# EasyEDA Pro project ProProject_CM4-AC180-OpenHD_2024-05-10.epro

# Schematic STARSEA
Create Date: 2024-04-03; Page Name: P1; Project Name: RPI-CM4-STARSEA; Schematic Name: STARSEA; Update Date: 2024-04-16; Company: VVZERO.COM; Drawed: Kinchin Fong; Page Size: A4; Part Number: JLCPCB-002; Reviewed: 嘉立创EDA; Version: V0.1
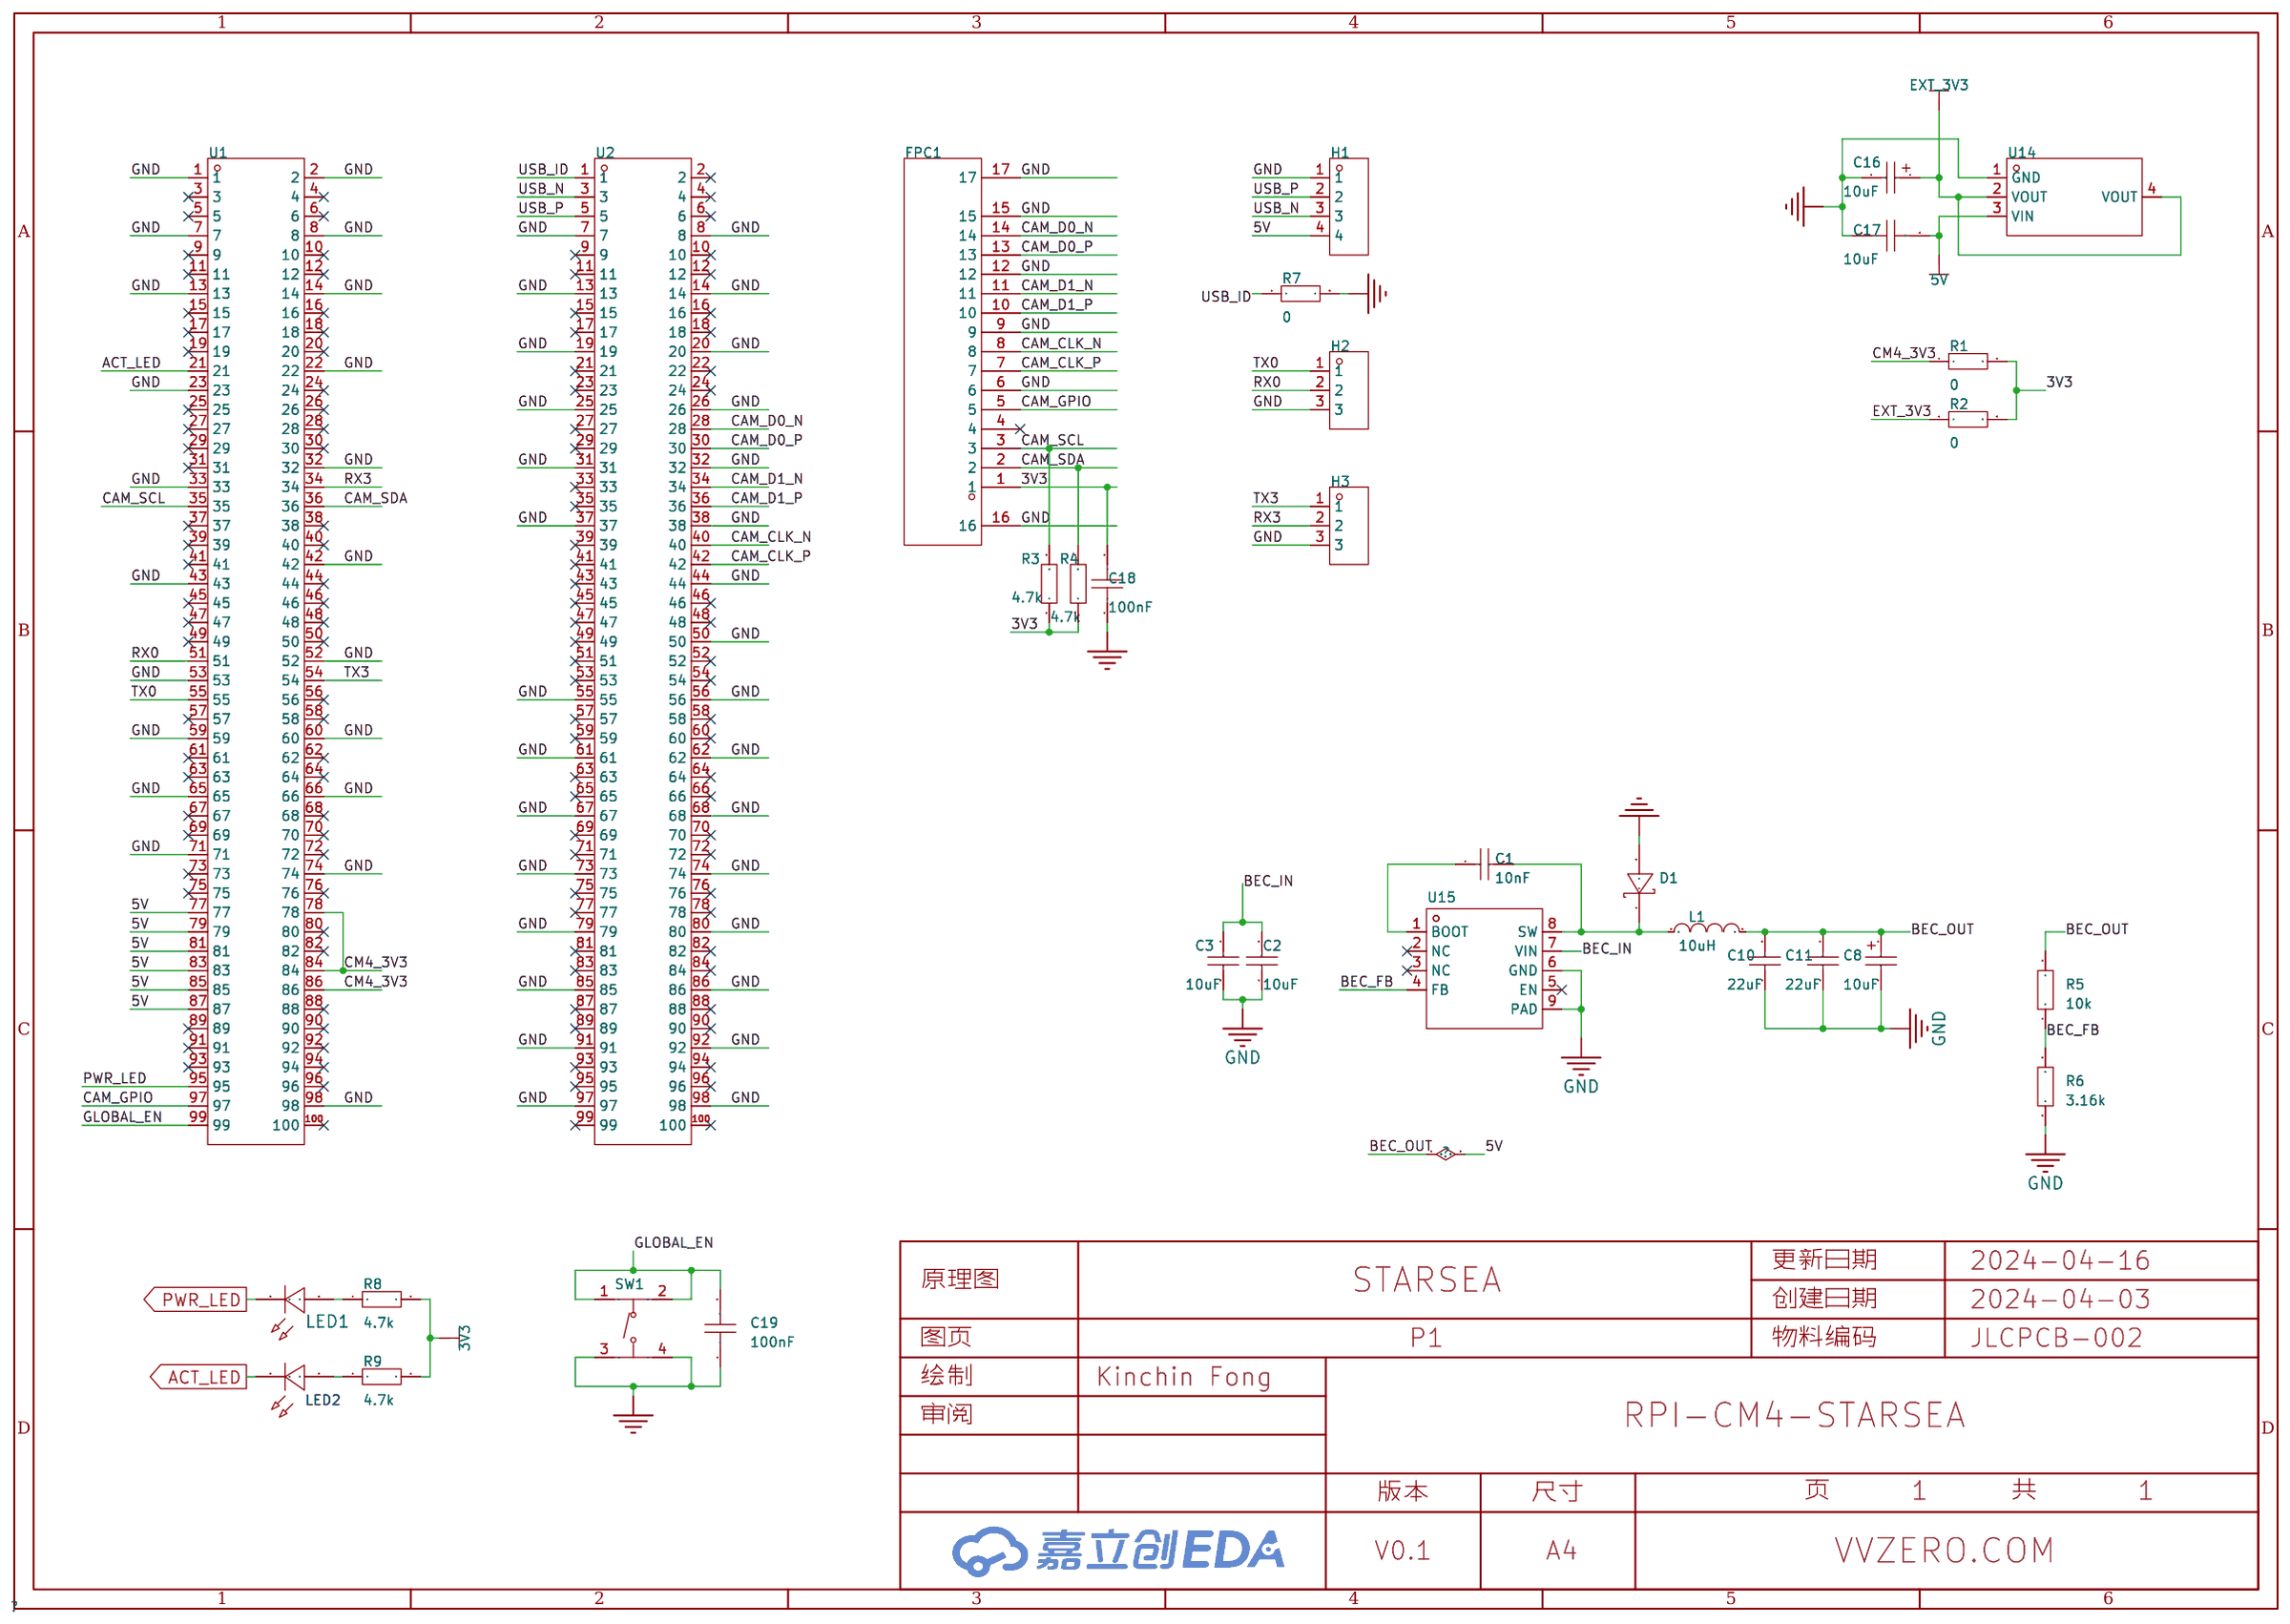
[diagram p0: schematic sheet]

## Parts
C1  10nF  [C0603]
C2  10uF  [C1206]
C3  10uF  [C1206]
C8  10uF  [CAP-SMD_L3.2-W1.6-RD-C7171]
C10  22uF  [C1206]
C11  22uF  [C1206]
C16  10uF  [CAP-SMD_L3.2-W1.6-RD-C7171]
C17  10uF  [C0603]
C18  100nF  [C0603]
C19  100nF  [C0603]
D1  SS34  [SMA_L4.3-W2.6-LS5.2-RD]
FPC1  AFA07-S15FCC-00  [FPC-SMD_AFA07-S15FCC-00]
H1  -  [HDR-TH_4P-P2.54-V-M]
H2  -  [HDR-TH_3P-P2.54-V-M]
H3  -  [HDR-TH_3P-P2.54-V-M]
L1  10uH  [IND-SMD_L7.3-W6.8]
LED1  -  [LED_0603]
LED2  -  [LED_0603]
R1  0  [R0603]
R2  0  [R0603]
R3  4.7k  [R0603]
R4  4.7k  [R0603]
R5  10k  [R0603]
R6  3.16k  [R0603]
R7  0  [R0603]
R8  4.7k  [R0603]
R9  4.7k  [R0603]
SW1  TS-1187A-B-A-B  [SW-SMD_4P-L5.1-W5.1-P3.70-LS6.5-TL-2]
U1  HC-PBB40C-100DS-0.4V-3.0-02  [CONN-SMD_100P-P0.40_X0408FVS-100F-LPV01]
U2  HC-PBB40C-100DS-0.4V-3.0-02  [CONN-SMD_100P-P0.40_X0408FVS-100F-LPV01]
U14  AMS1117-3.3  [SOT-223-3_L6.5-W3.4-P2.30-LS7.0-BR]
U15  RT8289GSP  [SOIC-8_L5.0-W4.0-P1.27-LS6.0-BL-EP2.0]

## Library data of the parts
C1 = 0603B103K500NT: 容值:10nF;精度:±10%;额定电压:50V;材质(温度系数):X7R;; LCSC Part Name: 10nF ±10% 50V; Supplier Part: C57112; Manufacturer: FH(风华); Supplier Footprint: 0603; JLCPCB Part Class: 基础库; Datasheet: https://atta.szlcsc.com/upload/public/pdf/source/20200305/C486355_26A10D38EF8C2A5C37091D0039909270.pdf; Supplier: LCSC; Tolerance: ±10%; Voltage Rated: 50V; Temperature Coefficient: X7R
C2 C3 = CL31A106KBHNNNE: 容值:10uF;精度:±10%;额定电压:50V;材质(温度系数):X5R;; LCSC Part Name: 10uF ±10% 50V; Supplier Part: C13585; Manufacturer: SAMSUNG(三星); Supplier Footprint: 1206; JLCPCB Part Class: 基础库; Datasheet: https://atta.szlcsc.com/upload/public/pdf/source/20160218/1457707763339.pdf; Supplier: LCSC; Tolerance: ±10%; Voltage Rated: 50V; Temperature Coefficient: X5R
C8 = TAJA106K016RNJ: 容值:10uF;精度:±10%;额定电压:16V;等效串联电阻:3Ω@100kHz;; LCSC Part Name: 10uF ±10% 16V; Supplier Part: C7171; Manufacturer: Kyocera AVX; Supplier Footprint: CASE-A-3216; JLCPCB Part Class: 基础库; Datasheet: https://atta.szlcsc.com/upload/public/pdf/source/20160107/1457707750344.pdf; Supplier: LCSC; Tolerance: ±10%; Rated Voltage: 16V; Equivalent Series Resistance(ESR): 3Ω@100kHz; Operating Temperature: -55℃~+125℃
C10 C11 = CL31A226KAHNNNE: 容值:22uF;精度:±10%;额定电压:25V;材质(温度系数):X5R;; LCSC Part Name: 22uF ±10% 25V; Supplier Part: C12891; Manufacturer: SAMSUNG(三星); Supplier Footprint: 1206; JLCPCB Part Class: 基础库; Datasheet: https://atta.szlcsc.com/upload/public/pdf/source/20160218/1457707763339.pdf; Supplier: LCSC; Tolerance: ±10%; Voltage Rated: 25V; Temperature Coefficient: X5R
C16 = TAJA106K016RNJ: 容值:10uF;精度:±10%;额定电压:16V;等效串联电阻:3Ω@100kHz;; LCSC Part Name: 10uF ±10% 16V; Supplier Part: C7171; Manufacturer: Kyocera AVX; Supplier Footprint: CASE-A-3216; JLCPCB Part Class: 基础库; Datasheet: https://atta.szlcsc.com/upload/public/pdf/source/20160107/1457707748093.pdf; Supplier: LCSC; Tolerance: ±10%; Rated Voltage: 16V; Equivalent Series Resistance(ESR): 3Ω@100kHz; Operating Temperature: -55℃~+125℃
C17-C19 = CAP_0603: Supplier Footprint: 0603
D1 = SS34_C8678: 二极管配置:独立式;正向压降(Vf):550mV@3A;直流反向耐压(Vr):40V;平均整流电流(Io):3A;; LCSC Part Name: 电压:40V 电流:3A; Supplier Part: C8678; Manufacturer: MDD; Supplier Footprint: SMA(DO-214AC); JLCPCB Part Class: 基础库; Datasheet: https://atta.szlcsc.com/upload/public/pdf/source/20230314/A80AE34493C69B89E2F4B1712F433538.pdf; Supplier: LCSC; Diode Configuration: 独立式; Forward Voltage (Vf@If): 550mV@3A; Reverse Voltage (Vr): 40V; Average Rectified Current (Io): 3A; Reverse Leakage Current (Ir): 500uA@40V
FPC1 = AFA07-S15FCC-00: 锁定特性:抽屉式;触点类型:下接;触点数量:15P;间距:1mm;安装类型:卧贴;; LCSC Part Name: 间距:1mm P数:15P 抽屉式 下接; Supplier Part: C262349; Manufacturer: JS(钜硕电子); Supplier Footprint: SMD,P=1mm,卧贴; JLCPCB Part Class: 扩展库; Datasheet: https://atta.szlcsc.com/upload/public/pdf/source/20191217/C262716_30B15E9A77BFCA4A54741C92DB3BE8CC.pdf; Supplier: LCSC; Locking Feature: 抽屉式; Contact Type: 下接; Number of Contacts: 15P; Pitch: 1mm; Mounting Type: 卧贴; FFC, FCB Thickness: 0.3mm; Height Above Board: 2.5mm
H1 = HDR-M_2.54_1x4P: Supplier Part: C492403; Supplier Footprint: 插件
H2 H3 = HDR-M_2.54_1x3P: Supplier Part: C2937625; Supplier Footprint: 插件
L1 = FXL0630-100-M: 电感值:10uH;精度:±20%;额定电流:4.5A;饱和电流(Isat):5.5A;类型:一体成型电感;; LCSC Part Name: 10uH ±20% 5.5A; Supplier Part: C167223; Manufacturer: cjiang(长江微电); Supplier Footprint: SMD,6.6x7mm; JLCPCB Part Class: 扩展库; Datasheet: https://atta.szlcsc.com/upload/public/pdf/source/20230516/3A080F5AF8C87BB81C3BA86E5F60E51A.pdf; Supplier: LCSC; Tolerance: ±20%; Rated Current: 4.5A; Saturation Current (Isat): 5.5A; DC Resistance (DCR): 68mΩ; Type: 一体成型电感
LED1 = LED_0603-R: Supplier Footprint: 0603
LED2 = LED_0603-G: Supplier Footprint: 0603
R1-R4 R7-R9 = Res_0603: Supplier Footprint: 0603
R5 = 0603WAF2402T5E: 电阻类型:厚膜电阻;阻值:24kΩ;精度:±1%;功率:100mW;最大工作电压:75V;温度系数:±100ppm/℃;; LCSC Part Name: 24kΩ ±1% 100mW 厚膜电阻; Supplier Part: C23352; Manufacturer: UNI-ROYAL(厚声); Supplier Footprint: 0603; JLCPCB Part Class: 基础库; Datasheet: https://atta.szlcsc.com/upload/public/pdf/source/20200306/C422600_1E6D84923E4A46A82E41ADD87F860B5C.pdf; Supplier: LCSC; Type: 厚膜电阻; Tolerance: ±1%; Power(Watts): 100mW; Overload Voltage (Max): 75V; Temperature Coefficient: ±100ppm/℃; Operating Temperature Range: -55℃~+155℃
R6 = 0603WAF2701T5E: 电阻类型:厚膜电阻;阻值:2.7kΩ;精度:±1%;功率:100mW;最大工作电压:75V;温度系数:±100ppm/℃;; LCSC Part Name: 2.7kΩ ±1% 100mW 厚膜电阻; Supplier Part: C13167; Manufacturer: UNI-ROYAL(厚声); Supplier Footprint: 0603; JLCPCB Part Class: 基础库; Datasheet: https://atta.szlcsc.com/upload/public/pdf/source/20200306/C422600_1E6D84923E4A46A82E41ADD87F860B5C.pdf; Supplier: LCSC; Type: 厚膜电阻; Tolerance: ±1%; Power(Watts): 100mW; Overload Voltage (Max): 75V; Temperature Coefficient: ±100ppm/℃; Operating Temperature Range: -55℃~+155℃
SW1 = TS-1187A-B-A-B: 电路结构:单刀单掷;按钮形状:圆形按钮;作用力:160gf;安装方式:立贴;开关长度:5.1mm;开关宽度:5.1mm;开关高度:1.5mm;带支架:不带;触点电流:50mA;额定电压(DC):12V;绝缘电阻:-;带灯:无;机械寿命:10万次;; LCSC Part Name: 5.1*5.1*1.5mm 立贴 轻触开关; Supplier Part: C318884; Manufacturer: XKB Connectivity(中国星坤); Supplier Footprint: SMD; JLCPCB Part Class: 基础库; Datasheet: https://atta.szlcsc.com/upload/public/pdf/source/20200227/C318890_053E50208A88A7BA1965D8746000774E.pdf; Supplier: LCSC; Circuit: 单刀单掷; Actuator Style: 圆形按钮; Operating Force: 160gf; Mounting Style: 立贴; Switch Length: 5.1mm; Switch Width: 5.1mm; Switch Height: 1.5mm; Strike Gundam: 不带; Contact Current: 50mA; Voltage Rating (DC): 12V; Actuator/Cap Color: 金色; With Lamp: 无; Mechanical Life: 10万次; Operating Temperature: -30℃~+85℃
U1 U2 = HC-PBB40C-100DS-0.4V-3.0-02: PIN总数:100P;间距:0.4mm;公母:母;安装方式:立贴;行数:2;额定电流:300mA;工作温度范围:-35℃~+85℃;; LCSC Part Name: PIN:100P 间距:0.4mm 母 立贴; Supplier Part: C19089295; Manufacturer: HCTL(华灿天禄); Supplier Footprint: SMD,P=0.4mm; JLCPCB Part Class: 扩展库; Datasheet: https://atta.szlcsc.com/upload/public/pdf/source/20231026/B42C748D7AAFF63F7EC2104F4CEA0747.pdf; Supplier: LCSC; Number of Pins: 100P; Pitch: 0.4mm; Gender: 母; Mounting Style: 立贴; Number of Rows: 2; Current Rating (Max): 300mA; Contact Material: 磷青铜; Operating Temperature Range: -35℃~+85℃
U14 = AMS1117-3.3_C6186: 输出类型:固定;输出极性:正;最大输入电压:-;输出电压:3.3V;输出电流:1A;电源纹波抑制比(PSRR):72dB@(120Hz);; LCSC Part Name: 输出3.3V 1A; Supplier Part: C6186; Manufacturer: AMS; Supplier Footprint: SOT-223; JLCPCB Part Class: 基础库; Datasheet: https://atta.szlcsc.com/upload/public/pdf/source/20180727/C6186_7A095716F0823C02F1997A905E26C086.pdf; Supplier: LCSC; Output Type: 固定; Output Voltage: 3.3V; MAX Output Current: 1A; Power Supply Rejection Ratio (PSRR): 72dB@(120Hz); Dropout Voltage: 1.3V@(800mA); Output Polarity: 正; Number of Outputs: 1; Output Current: 1A
U15 = RT8289GSP: 功能类型:降压型;输出类型:可调;输入电压:5.5V~32V;输出电压:1.222V~26V;输出电流(最大值):5A;; Supplier Part: C39202; Manufacturer: RICHTEK(立锜); Supplier Footprint: SOIC-8-EP; JLCPCB Part Class: 扩展库; Datasheet: https://atta.szlcsc.com/upload/public/pdf/source/20141219/1457707253176.pdf; Supplier: LCSC; Function: 降压型; Output Type: 可调; Input Voltage: 5.5V~32V; Output Voltage: 1.222V~26V; Output Current (Max): 5A; Switching Frequency: 500kHz; Operating Temperature: -40℃~+85℃@(TA); Synchronous Rectification: 否; Number of Outputs: 1; Topology: 降压式; Switch tube (built-in/external): 内置

## Nets
3V3: C18.2 FPC1.1 R1.2 R2.2 R3.1 R4.1 R8.2 R9.2
5V: C8.1 C10.2 C11.2 C17.2 H1.4 L1.2 R5.2 U1.77 U1.79 U1.81 U1.83 U1.85 U1.87 U14.3(VIN)
GND: C2.1 C3.1 C8.2 C10.1 C11.1 C16.2 C17.1 C18.1 C19.1 D1.2(A) FPC1.6 FPC1.9 FPC1.12 FPC1.15 FPC1.16 FPC1.17 H1.1 H2.3 H3.3 R6.1 R7.2 SW1.3(C) SW1.4(D) U1.1 U1.2 U1.7 U1.8 U1.13 U1.14 U1.22 U1.23 U1.32 U1.33 U1.42 U1.43 U1.52 U1.53 U1.59 U1.60 U1.65 U1.66 U1.71 U1.74 U1.98 U2.7 U2.8 U2.13 U2.14 U2.19 U2.20 U2.25 U2.26 U2.31 U2.32 U2.37 U2.38 U2.44 U2.50 U2.55 U2.56 U2.61 U2.62 U2.67 U2.68 U2.73 U2.74 U2.79 U2.80 U2.85 U2.86 U2.91 U2.92 U2.97 U2.98 U14.1(GND) U15.6(GND) U15.9(PAD)
ACT_LED: LED2.1(C) U1.21
BEC_FB: R5.1 R6.2 U15.4(FB)
BEC_IN: C2.2 C3.2 U15.7(VIN)
CAM_CLK_N: FPC1.8 U2.40
CAM_CLK_P: FPC1.7 U2.42
CAM_D0_N: FPC1.14 U2.28
CAM_D0_P: FPC1.13 U2.30
CAM_D1_N: FPC1.11 U2.34
CAM_D1_P: FPC1.10 U2.36
CAM_GPIO: FPC1.5 U1.97
CAM_SCL: FPC1.3 R3.2 U1.35
CAM_SDA: FPC1.2 R4.2 U1.36
CM4_3V3: R1.1 U1.78 U1.84 U1.86
EXT_3V3: C16.1 R2.1 U14.2(VOUT) U14.4(VOUT)
GLOBAL_EN: C19.2 SW1.1(A) SW1.2(B) U1.99
PWR_LED: LED1.1(C) U1.95
RX0: H2.2 U1.51
RX3: H3.2 U1.34
TX0: H2.1 U1.55
TX3: H3.1 U1.54
USB_ID: R7.1 U2.1
USB_N: H1.3 U2.3
USB_P: H1.2 U2.5
$1N6118: C1.2 D1.1(K) L1.1 U15.8(SW)
$1N6119: C1.1 U15.1(BOOT)
$1N8732: LED1.2(A) R8.1
$1N8740: LED2.2(A) R9.1

Not connected (* = marked no-connect by the designer): FPC1 4*; U1 3* 4* 5* 6* 9* 10* 11* 12* 15* 16* 17* 18* 19* 20* 24* 25* 26* 27* 28* 29* 30* 31* 37* 38* 39* 40* 41* 44* 45* 46* 47* 48* 49* 50* 56* 57* 58* 61* 62* 63* 64* 67* 68* 69* 70* 72* 73* 75* 76* 80* 82* 88* 89* 90* 91* 92* 93* 94* 96* 100*; U2 2* 4* 6* 9* 10* 11* 12* 15* 16* 17* 18* 21* 22* 23* 24* 27* 29* 33* 35* 39* 41* 43* 45* 46* 47* 48* 49* 51* 52* 53* 54* 57* 58* 59* 60* 63* 64* 65* 66* 69* 70* 71* 72* 75* 76* 77* 78* 81* 82* 83* 84* 87* 88* 89* 90* 93* 94* 95* 96* 99* 100*; U15 2(NC)* 3(NC)* 5(EN)*

# Board STARSEA_PCB
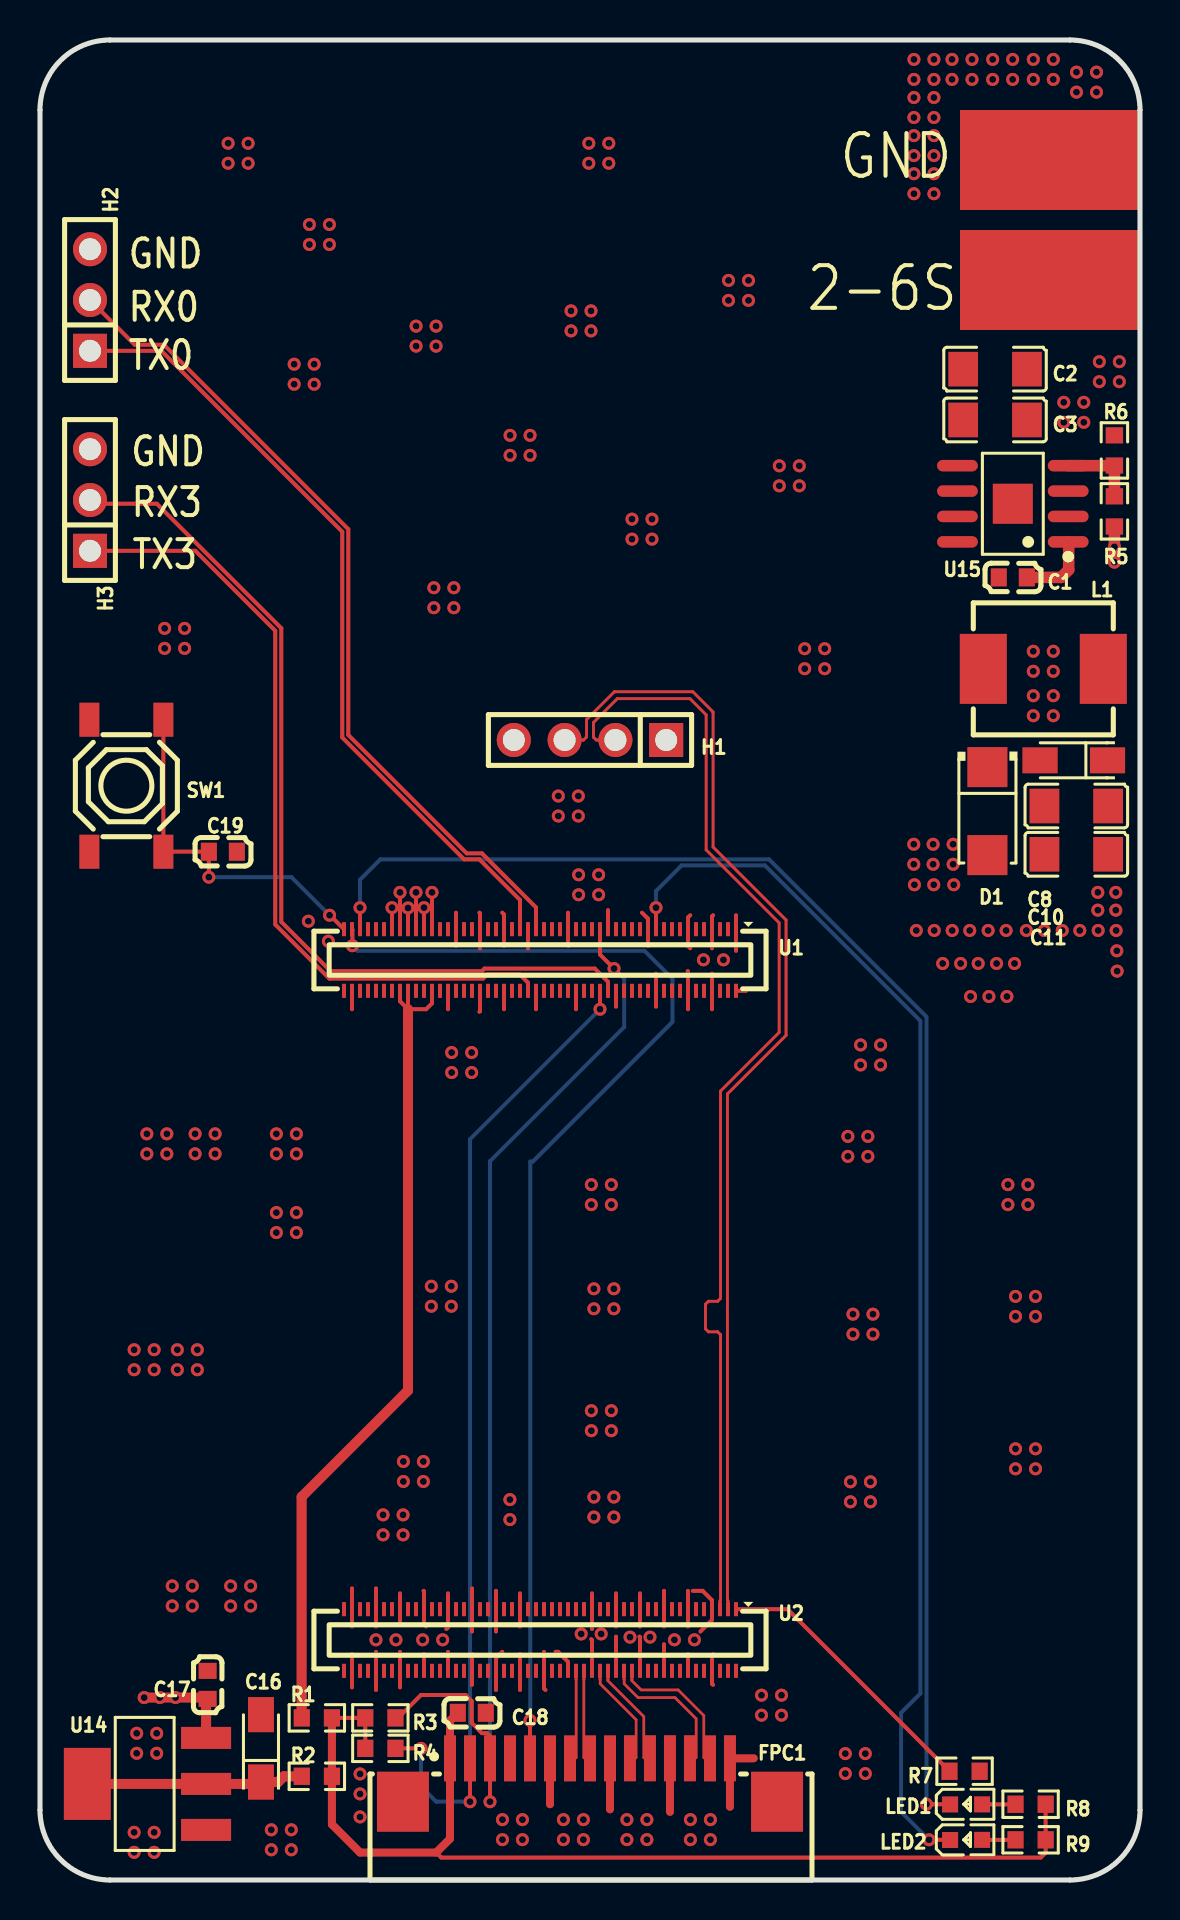
[diagram p1: board, top side]
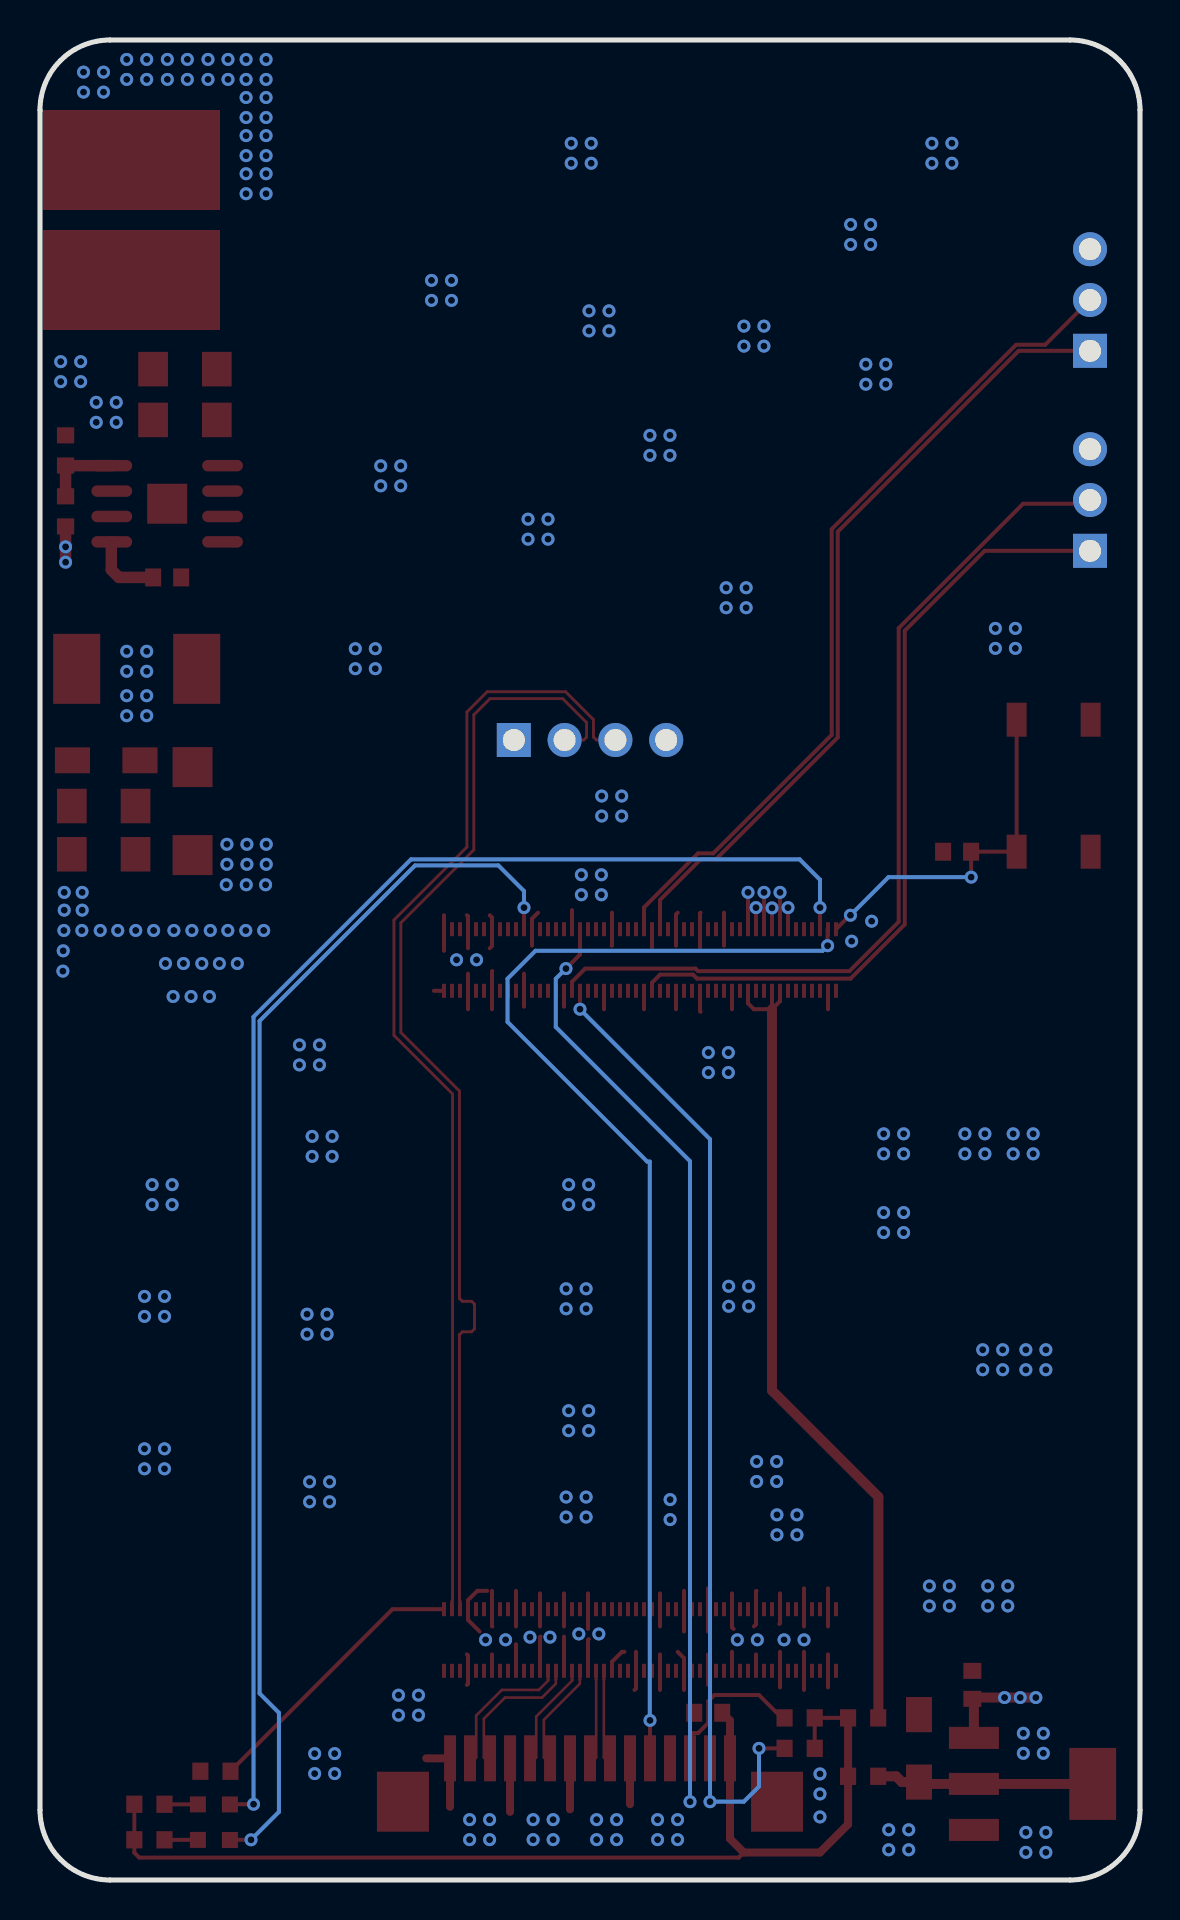
[diagram p2: board, bottom side, seen from below]

Outline 55 x 92 mm; copper layers: Top Layer, Inner1, Inner2, Bottom Layer. Coordinates in mm from the lower left corner of the outline.
Outline path: 0,88.5 0,3.5 arc(1.03,1.03) 3.5,0 51.5,0 arc(53.97,1.03) 55,3.5 55,88.5 arc(53.97,90.97) 51.5,92 3.5,92 arc(1.03,90.97) 0,88.5
Stack: Top Layer 0.035mm 外层铜厚1oz / Dielectric1 0.2104mm 7628 RC49% 8.6mil / Inner1 0.0152mm 内层铜厚 / Dielectric2 1.065mm 1.1mm H/HOZ 含铜 / Inner2 0.0152mm 内层铜厚 / Dielectric3 0.2104mm 7628 RC49% 8.6mil / Bottom Layer 0.035mm 外层铜厚1oz

## Design rules (mm)
net USB_N: USB
net USB_P: USB
net CAM_D0_N: CAM_D0
net CAM_D0_P: CAM_D0
net CAM_D1_N: CAM_D1
net CAM_D1_P: CAM_D1
net CAM_CLK_N: CAM_CLK
net CAM_CLK_P: CAM_CLK
template: JLC041611-3313
spacing copperThickness1oz (default): track to track 0.102, other pairs 0 to 0.3
track width copperThickness1oz (default): min 0.1, default 0.2, max 2.5
differential pair differentialPair (default): width min 0.1, default 0.25, max 2.5; gap min 0.15, default 0.15
differential pair USB: width min 0.146, default 0.146, max 0.146; gap min 0.2, default 0.2
differential pair CSI-2: width min 0.133, default 0.133, max 0.133; gap min 0.25, default 0.25
via viaSize (default): diameter min 0.3, default 0.65, max 10; hole min 0.2, default 0.35, max 7
net USB_N uses USB
net USB_P uses USB
net CAM_D0_N uses CSI-2
net CAM_D0_P uses CSI-2
net CAM_D1_N uses CSI-2
net CAM_D1_P uses CSI-2
net CAM_CLK_N uses CSI-2
net CAM_CLK_P uses CSI-2
diff pair USB uses USB
diff pair CAM_D0 uses CSI-2
diff pair CAM_D1 uses CSI-2
diff pair CAM_CLK uses CSI-2
['net', 'gnd'] ['NET', 'USB_N'] uses copper_diffpair
['net', 'gnd'] ['NET', 'USB_P'] uses copper_diffpair
['net', 'gnd'] ['NET', 'CAM_D0_N'] uses copper_diffpair
['net', 'gnd'] ['NET', 'CAM_D0_P'] uses copper_diffpair
['net', 'gnd'] ['NET', 'CAM_D1_N'] uses copper_diffpair
['net', 'gnd'] ['NET', 'CAM_D1_P'] uses copper_diffpair
['net', 'gnd'] ['NET', 'CAM_CLK_N'] uses copper_diffpair
['net', 'gnd'] ['NET', 'CAM_CLK_P'] uses copper_diffpair
pour e1534 uses power
pour e1536 uses power
pour e1538 uses power
pour e1544 uses power
pour e1553 uses power
pour e1616 uses power

## Placement (name value [footprint] x y rotation side)
C1  10nF  [C0603]  48.64 65.13 180 top
C2  10uF  [C1206]  47.75 75.54 180 top
C3  10uF  [C1206]  47.75 73 180 top
C8  10uF  [CAP-SMD_L3.2-W1.6-RD-C7171]  51.69 55.98 180 top
C10  22uF  [C1206]  51.82 53.7 0 top
C11  22uF  [C1206]  51.82 51.29 0 top
C16  10uF  [CAP-SMD_L3.2-W1.6-RD-C7171]  11.05 6.58 90 top
C17  10uF  [C0603]  8.38 9.76 270 top
C18  100nF  [C0603]  21.59 8.36 180 top
C19  100nF  [C0603]  9.14 51.41 180 top
D1  SS34  [SMA_L4.3-W2.6-LS5.2-RD]  47.37 53.44 270 top
FPC1  AFA07-S15FCC-00  [FPC-SMD_AFA07-S15FCC-00]  27.5 5 0 top
H1  -  [HDR-TH_4P-P2.54-V-M]  27.5 57 180 top
H2  -  [HDR-TH_3P-P2.54-V-M]  2.5 79 90 top
H3  -  [HDR-TH_3P-P2.54-V-M]  2.5 69 90 top
L1  10uH  [IND-SMD_L7.3-W6.8]  50.16 60.56 0 top
LED1  -  [LED_0603]  46.35 3.79 0 top
LED2  -  [LED_0603]  46.35 2.01 0 top
NOREF  -  [Pad_e49]  50.5 80 0 top
NOREF#2  -  [Pad_e48]  50.5 86 0 top
R1  0  [R0603]  13.84 8.11 0 top
R2  0  [R0603]  13.84 5.19 0 top
R3  4.7k  [R0603]  17.02 8.11 0 top
R4  4.7k  [R0603]  17.02 6.58 0 top
R5  10k  [R0603]  53.72 68.43 270 top
R6  3.16k  [R0603]  53.72 71.48 270 top
R7  0  [R0603]  46.23 5.44 0 top
R8  4.7k  [R0603]  49.53 3.79 0 top
R9  4.7k  [R0603]  49.53 2.01 0 top
SW1  TS-1187A-B-A-B  [SW-SMD_4P-L5.1-W5.1-P3.70-LS6.5-TL-2]  4.32 54.72 270 top
U1  HC-PBB40C-100DS-0.4V-3.0-02  [CONN-SMD_100P-P0.40_X0408FVS-100F-LPV01]  25 46 180 top
U2  HC-PBB40C-100DS-0.4V-3.0-02  [CONN-SMD_100P-P0.40_X0408FVS-100F-LPV01]  25 12 180 top
U14  AMS1117-3.3  [SOT-223-3_L6.5-W3.4-P2.30-LS7.0-BR]  5.33 4.8 0 top
U15  RT8289GSP  [SOIC-8_L5.0-W4.0-P1.27-LS6.0-BL-EP2.0]  48.64 68.81 90 top

## Footprints (pads in the part's own frame, mm; a bottom-side part is the same pattern mirrored in y, then rotated)
C0603
  rect 0.8x0.9 smd: 1(-0.7,0) 2(0.7,0)
C1206
  rect 1.485x1.728 smd: 1(-1.593,0) 2(1.593,0)
CAP-SMD_L3.2-W1.6-RD-C7171
  rect 1.758x1.296 smd: 1(-1.687,0) 2(1.687,0)
CONN-SMD_100P-P0.40_X0408FVS-100F-LPV01
  rect 0.2x0.7 smd: 1(-9.8,-1.54) 2(-9.8,1.54) 3(-9.4,-1.54) 4(-9.4,1.54) 5(-9,-1.54) 6(-9,1.54) 7(-8.6,-1.54) 8(-8.6,1.54) 9(-8.2,-1.54) 10(-8.2,1.54) 11(-7.8,-1.54) 12(-7.8,1.54) 13(-7.4,-1.54) 14(-7.4,1.54) 15(-7,-1.54) 16(-7,1.54) 17(-6.6,-1.54) 18(-6.6,1.54) 19(-6.2,-1.54) 20(-6.2,1.54) 21(-5.8,-1.54) 22(-5.8,1.54) 23(-5.4,-1.54) 24(-5.4,1.54) 25(-5,-1.54) 26(-5,1.54) 27(-4.6,-1.54) 28(-4.6,1.54) 29(-4.2,-1.54) 30(-4.2,1.54) 31(-3.8,-1.54) 32(-3.8,1.54) 33(-3.4,-1.54) 34(-3.4,1.54) 35(-3,-1.54) 36(-3,1.54) 37(-2.6,-1.54) 38(-2.6,1.54) 39(-2.2,-1.54) 40(-2.2,1.54) 41(-1.8,-1.54) 42(-1.8,1.54) 43(-1.4,-1.54) 44(-1.4,1.54) 45(-1,-1.54) 46(-1,1.54) 47(-0.6,-1.54) 48(-0.6,1.54) 49(-0.2,-1.54) 50(-0.2,1.54) 51(0.2,-1.54) 52(0.2,1.54) 53(0.6,-1.54) 54(0.6,1.54) 55(1,-1.54) 56(1,1.54) 57(1.4,-1.54) 58(1.4,1.54) 59(1.8,-1.54) 60(1.8,1.54) 61(2.2,-1.54) 62(2.2,1.54) 63(2.6,-1.54) 64(2.6,1.54) 65(3,-1.54) 66(3,1.54) 67(3.4,-1.54) 68(3.4,1.54) 69(3.8,-1.54) 70(3.8,1.54) 71(4.2,-1.54) 72(4.2,1.54) 73(4.6,-1.54) 74(4.6,1.54) 75(5,-1.54) 76(5,1.54) 77(5.4,-1.54) 78(5.4,1.54) 79(5.8,-1.54) 80(5.8,1.54) 81(6.2,-1.54) 82(6.2,1.54) 83(6.6,-1.54) 84(6.6,1.54) 85(7,-1.54) 86(7,1.54) 87(7.4,-1.54) 88(7.4,1.54) 89(7.8,-1.54) 90(7.8,1.54) 91(8.2,-1.54) 92(8.2,1.54) 93(8.6,-1.54) 94(8.6,1.54) 95(9,-1.54) 96(9,1.54) 97(9.4,-1.54) 98(9.4,1.54) 99(9.8,-1.54) 100(9.8,1.54)
FPC-SMD_AFA07-S15FCC-00
  rect 0.6x2.3 smd: 1(-7,1.083) 2(-6,1.083) 3(-5,1.083) 4(-4,1.083) 5(-3,1.083) 6(-2,1.083) 7(-1,1.083) 8(0,1.083) 9(1,1.083) 10(1.998,1.085) 11(2.998,1.085) 12(3.998,1.085) 13(4.998,1.085) 14(6,1.083) 15(6.998,1.085)
  rect 2.6x3 smd: 16(-9.352,-1.085) 17(9.352,-1.085)
HDR-TH_3P-P2.54-V-M
  rect 1.7x1.7 hole 1.1: 1(-2.54,0)
  round 1.7 hole 1.1: 2(0,0) 3(2.54,0)
HDR-TH_4P-P2.54-V-M
  rect 1.7x1.7 hole 1.1: 1(-3.81,0)
  round 1.7 hole 1.1: 2(-1.27,0) 3(1.27,0) 4(3.81,0)
IND-SMD_L7.3-W6.8
  rect 2.35x3.5 smd: 1(-3,0) 2(3,0)
LED_0603
  rect 0.8x0.8 smd: 1(-0.851,-0.01) 2(0.75,-0.005)
Pad_e48
  rect 9x5 smd: 101(0,0)
Pad_e49
  rect 9x5 smd: 102(0,0)
R0603
  rect 0.806x0.864 smd: 1(-0.753,0) 2(0.753,0)
SMA_L4.3-W2.6-LS5.2-RD
  rect 2x2 smd: 1(-2.2,0) 2(2.2,0)
SOIC-8_L5.0-W4.0-P1.27-LS6.0-BL-EP2.0
  oval 0.574x2.038 smd: 1(-1.905,-2.769) 2(-0.635,-2.769) 3(0.635,-2.769) 4(1.905,-2.769) 5(1.905,2.769) 6(0.635,2.769) 7(-0.635,2.769) 8(-1.905,2.769)
  rect 2x2 smd: 9(0,0)
SOT-223-3_L6.5-W3.4-P2.30-LS7.0-BR
  rect 2.5x1.1 smd: 1(2.97,-2.3) 2(2.97,0) 3(2.97,2.3)
  rect 2.34x3.6 smd: 4(-2.97,0)
SW-SMD_4P-L5.1-W5.1-P3.70-LS6.5-TL-2
  rect 1.7x1 smd: 1(-3.3,1.85) 2(3.3,1.85) 3(-3.3,-1.85) 4(3.3,-1.85)

## Nets
As in the schematic, except:
GND: C2.1 C3.1 C8.2 C10.1 C11.1 C16.2 C17.1 C18.1 C19.1 D1.2 FPC1.6 FPC1.9 FPC1.12 FPC1.15 FPC1.16 FPC1.17 H1.1 H2.3 H3.3 NOREF#2.101 R6.1 R7.2 SW1.3 SW1.4 U1.1 U1.2 U1.7 U1.8 U1.13 U1.14 U1.22 U1.23 U1.32 U1.33 U1.42 U1.43 U1.52 U1.53 U1.59 U1.60 U1.65 U1.66 U1.71 U1.74 U1.98 U2.7 U2.8 U2.13 U2.14 U2.19 U2.20 U2.25 U2.26 U2.31 U2.32 U2.37 U2.38 U2.44 U2.50 U2.55 U2.56 U2.61 U2.62 U2.67 U2.68 U2.73 U2.74 U2.79 U2.80 U2.85 U2.86 U2.91 U2.92 U2.97 U2.98 U14.1 U15.6 U15.9
BEC_IN: C2.2 C3.2 NOREF.102 U15.7

Pads without a net: FPC1 4; U1 3 4 5 6 9 10 11 12 15 16 17 18 19 20 24 25 26 27 28 29 30 31 37 38 39 40 41 44 45 46 47 48 49 50 56 57 58 61 62 63 64 67 68 69 70 72 73 75 76 80 82 88 89 90 91 92 93 94 96 100; U2 2 4 6 9 10 11 12 15 16 17 18 21 22 23 24 27 29 33 35 39 41 43 45 46 47 48 49 51 52 53 54 57 58 59 60 63 64 65 66 69 70 71 72 75 76 77 78 81 82 83 84 87 88 89 90 93 94 95 96 99 100; U15 2 3 5

## Via types
v1: diameter 0.65, hole 0.35, Top Layer to Bottom Layer, 314 vias

## Routing (per net, layer and track width the routed paths; a pad name or vN(x,y) marks a point on that pad's centre or on a via; arc(x,y) is an arc through that point)
3V3: length 54.8
  Top Layer w0.2: R8.2 R9.2 50.28,1.37 50.04,1.12 20.07,1.12 19.81,1.38 ; R4.1 R3.1 R1.2
  Top Layer w0.4: C18.2 20.5,7.97 FPC1.1 20.5,2.06 19.81,1.38 16,1.38 14.6,2.78 R2.2 R1.2
5V: length 17.7
  Top Layer w0.2: 18,48.62 v1(17.6,48.62) U1.87 ; 18,48.62 v1(18,49.38) ; 18,48.62 U1.85 ; 18,48.62 18.8,48.62 ; v1(19.2,48.62) 19.6,48.62 ; v1(19.2,48.62) U1.79 ; v1(19.2,48.62) 18.8,48.62 ; 19.6,48.62 U1.77 ; 19.6,48.62 v1(19.6,49.38) ; U1.81 18.8,48.62 ; 18.8,48.62 v1(18.8,49.38) ; U1.83 v1(18.4,48.6)
  Top Layer w0.5: U14.3 8.3,8.98 8.38,9.06 8.32,9.12 v1(6.77,9.12) v1(5.99,9.12) v1(5.21,9.12)
  Top Layer w0.574: v1(53.72,65.89) v1(53.72,66.66) R5.2
  vias: v1(43.81,47.48) v1(44.71,47.48) v1(45.13,45.83) v1(45.61,47.48) v1(46.03,45.83) v1(46.49,47.48) v1(46.53,44.17) v1(46.91,45.83) v1(47.41,47.48) v1(47.45,44.17) v1(47.83,45.83) v1(48.3,47.48) v1(48.35,44.17) v1(48.73,45.83) v1(49.32,47.48) v1(50.21,47.48) v1(51.11,47.48) v1(51.99,47.48) v1(52.89,49.38) v1(52.89,48.49) v1(52.91,47.48) v1(53.79,49.38) v1(53.79,48.49) v1(53.81,47.48) v1(53.84,46.46) v1(53.86,45.44)
GND: length 89.9
  Top Layer w0.2: 15.6,12.68 U2.97 15.6,14.58 ; U1.66 22,43.44 21.97,43.41 ; 26.4,48.36 U1.43 26.4,46.73 26.42,46.71 ; 24,11.28 U2.56 24,9.5 ; 33.6,45.32 U1.8 33.6,43.54 ; 29.97,12.17 30,12.14 U2.26 ; 23.11,48.36 23.2,48.28 U1.59 23.2,46.71 ; U2.32 28.8,12.17 ; U1.98 15.6,43.54 ; 18,11.41 U2.86 18,9.63 ; 22.8,12.42 U2.61 22.8,14.46 ; 25.2,11.41 U2.50 25.2,9.58 25.27,9.5 ; 30,14.33 U2.25 30,12.68 ; U1.74 20.4,43.54 ; 20.8,46.71 U1.71 20.8,48.36 ; U1.42 26.8,43.54 ; 33.6,46.59 U1.7 33.6,48.18 33.66,48.24 ; U1.53 24.4,46.59 ; 19.3,12.68 19.2,12.78 U2.79 19.2,14.43 19.18,14.46 ; 25.78,11.41 25.9,11.41 26.4,10.91 U2.44 ; 32.51,46.59 32.4,46.7 U1.13 32.4,48.13 32.51,48.24 ; 18.03,12.81 18,12.84 U2.85 18,14.33 ; 32.4,43.54 U1.14 32.4,45.43 32.38,45.44 ; U2.80 19.2,11.28 ; U2.38 27.6,12 27.56,12.04 ; 32.38,12.68 32.4,12.69 U2.13 32.4,14.46 ; 30.8,43.67 U1.22 30.8,45.32 ; 23.11,11.41 22.8,11.09 U2.62 22.8,9.5 ; 21.6,11.28 U2.68 21.6,9.76 ; 21.6,14.58 U2.67 21.6,12.42 ; 27.6,14.33 U2.37 27.6,12.55 ; 21.97,48.36 22,48.34 U1.65 22,46.59 ; 30.1,48.36 30.4,48.06 U1.23 30.4,46.71 ; 16.8,14.58 U2.91 16.8,12.68 ; 33.66,11.28 33.6,11.23 U2.8 33.6,9.81 33.66,9.76 ; U2.20 31.2,11.79 ; 16.8,9.5 U2.92 16.8,11.41 ; 24,14.33 U2.55 24,12.68 ; U1.33 28.4,48.49 ; 31.2,12.68 U2.19 31.2,14.46 ; 28.8,14.33 U2.31 28.8,12.68 ; 34.8,46.46 U1.1 34.8,48.24 ; 32.64,14.46 33.13,14.46 33.6,13.99 U2.7 33.6,13 33.02,12.42 ; U1.52 24.8,43.54 ; 20.32,12.55 20.4,12.63 U2.73 20.4,14.33 ; 15.6,11.28 U2.98 15.6,9.63 ; U1.32 28.8,43.67 ; U1.2 35.31,44.46 ; U1.60 23.2,43.54 ; U2.14 32.4,11.28 ; U2.74 20.4,11.41
  Top Layer w0.4: 35.69,6.09 FPC1.15 34.5,3.66 ; FPC1.9 28.5,3.53 ; FPC1.6 25.5,3.79 ; FPC1.12 31.5,3.41
  vias: v1(4.71,26.51) v1(4.71,25.51) v1(4.71,2.38) v1(4.71,1.38) v1(4.83,7.34) v1(4.83,6.34) v1(5.34,37.31) v1(5.34,36.31) v1(5.71,26.51) v1(5.71,25.51) v1(5.71,2.38) v1(5.71,1.38) v1(5.83,7.34) v1(5.83,6.34) v1(6.23,62.58) v1(6.23,61.58) v1(6.34,37.31) v1(6.34,36.31) v1(6.61,14.7) v1(6.61,13.7) v1(6.87,26.51) v1(6.87,25.51) v1(7.23,62.58) v1(7.23,61.58) v1(7.61,14.7) v1(7.61,13.7) v1(7.75,37.31) v1(7.75,36.31) v1(7.87,26.51) v1(7.87,25.51) v1(8.75,37.31) v1(8.75,36.31) v1(9.41,86.84) v1(9.41,85.84) v1(9.53,14.7) v1(9.53,13.7) v1(10.41,86.84) v1(10.41,85.84) v1(10.53,14.7) v1(10.53,13.7) v1(11.56,2.51) v1(11.56,1.51) v1(11.82,37.31) v1(11.82,36.31) v1(11.82,33.37) v1(11.82,32.37) v1(12.56,2.51) v1(12.56,1.51) v1(12.71,75.79) v1(12.71,74.79) v1(12.82,37.31) v1(12.82,36.31) v1(12.82,33.37) v1(12.82,32.37) v1(13.42,47.94) v1(13.47,82.77) v1(13.47,81.77) v1(13.71,75.79) v1(13.71,74.79) v1(14.42,46.94) v1(14.47,82.77) v1(14.47,81.77) v1(16,5.3) v1(16,4.3) v1(16,3.15) v1(16.8,12.01) v1(17.15,18.26) v1(17.15,17.26) v1(17.8,12.01) v1(18.17,20.93) v1(18.17,19.93) v1(18.15,18.26) v1(18.15,17.26) v1(18.8,77.69) v1(18.8,76.69) v1(19.13,12.01) v1(19.17,20.93) v1(19.17,19.93) v1(19.57,29.69) v1(19.57,28.69) v1(19.69,64.61) v1(19.69,63.61) v1(19.8,77.69) v1(19.8,76.69) v1(20.13,12.01) v1(20.58,41.37) v1(20.58,40.37) v1(20.57,29.69) v1(20.57,28.69) v1(20.69,64.61) v1(20.69,63.61) v1(21.58,41.37) v1(21.58,40.37) v1(23.12,3.02) v1(23.12,2.02) v1(23.5,72.23) v1(23.5,71.23) v1(23.5,19.02) v1(23.5,18.02) v1(24.12,3.02) v1(24.12,2.02) v1(24.5,72.23) v1(24.5,71.23) v1(25.92,54.2) v1(25.92,53.2) v1(26.17,3.02) v1(26.17,2.02) v1(26.55,78.46) v1(26.55,77.46) v1(26.92,54.2) v1(26.92,53.2) v1(26.93,50.26) v1(26.93,49.26) v1(27.06,12.3) v1(27.17,3.02) v1(27.17,2.02) v1(27.44,86.84) v1(27.44,85.84) v1(27.55,78.46) v1(27.55,77.46) v1(27.57,34.77) v1(27.57,33.77) v1(27.57,23.47) v1(27.57,22.47) v1(27.69,29.56) v1(27.69,28.56) v1(27.69,19.15) v1(27.69,18.15) v1(27.93,50.26) v1(27.93,49.26) v1(28.06,12.3) v1(28.44,86.84) v1(28.44,85.84) v1(28.57,34.77) v1(28.57,33.77) v1(28.57,23.47) v1(28.57,22.47) v1(28.69,29.56) v1(28.69,28.56) v1(28.69,19.15) v1(28.69,18.15) v1(29.34,3.02) v1(29.34,2.02) v1(29.5,12.14) v1(29.6,68.04) v1(29.6,67.04) v1(30.34,3.02) v1(30.34,2.02) v1(30.5,12.14) v1(30.6,68.04) v1(30.6,67.04) v1(31.72,12.01) v1(32.52,3.02) v1(32.52,2.02) v1(32.72,12.01) v1(33.17,46.01) v1(33.52,3.02) v1(33.52,2.02) v1(34.17,46.01) v1(34.43,79.98) v1(34.43,78.98) v1(35.43,79.98) v1(35.43,78.98) v1(36.08,9.24) v1(36.08,8.24) v1(36.97,70.71) v1(36.97,69.71) v1(37.08,9.24) v1(37.08,8.24) v1(37.97,70.71) v1(37.97,69.71) v1(38.24,61.56) v1(38.24,60.56) v1(39.24,61.56) v1(39.24,60.56) v1(40.27,6.32) v1(40.27,5.32) v1(40.39,37.18) v1(40.39,36.18) v1(40.52,19.91) v1(40.52,18.91) v1(40.65,28.29) v1(40.65,27.29) v1(41.03,41.75) v1(41.03,40.75) v1(41.27,6.32) v1(41.27,5.32) v1(41.39,37.18) v1(41.39,36.18) v1(41.52,19.91) v1(41.52,18.91) v1(41.65,28.29) v1(41.65,27.29) v1(42.03,41.75) v1(42.03,40.75) v1(43.7,91.03) v1(43.7,90.03) v1(43.7,89.12) v1(43.7,88.12) v1(43.7,87.22) v1(43.7,86.22) v1(43.7,85.31) v1(43.7,84.31) v1(43.69,51.79) v1(43.69,50.79) v1(43.72,49.76) v1(44.7,91.03) v1(44.7,90.03) v1(44.7,89.12) v1(44.7,88.12) v1(44.7,87.22) v1(44.7,86.22) v1(44.7,85.31) v1(44.7,84.31) v1(44.66,51.79) v1(44.66,50.79) v1(44.69,49.76) v1(45.6,91.03) v1(45.6,90.03) v1(45.66,51.79) v1(45.66,50.79) v1(45.69,49.76) v1(46.6,91.03) v1(46.6,90.03) v1(47.63,91.03) v1(47.63,90.03) v1(48.4,34.77) v1(48.4,33.77) v1(48.63,91.03) v1(48.63,90.03) v1(48.78,29.18) v1(48.78,28.18) v1(48.78,21.56) v1(48.78,20.56) v1(49.4,34.77) v1(49.4,33.77) v1(49.66,91.03) v1(49.66,90.03) v1(49.66,61.44) v1(49.66,60.44) v1(49.66,59.21) v1(49.66,58.21) v1(49.78,29.18) v1(49.78,28.18) v1(49.78,21.56) v1(49.78,20.56) v1(50.66,91.03) v1(50.66,90.03) v1(50.66,61.44) v1(50.66,60.44) v1(50.66,59.21) v1(50.66,58.21) v1(51.19,73.88) v1(51.19,72.88) v1(51.82,90.39) v1(51.82,89.39) v1(52.19,73.88) v1(52.19,72.88) v1(52.82,90.39) v1(52.82,89.39) v1(52.97,75.92) v1(52.97,74.92) v1(53.97,75.92) v1(53.97,74.92)
ACT_LED: length 61.9
  Top Layer w0.2: U1.21 v1(30.8,48.62) ; v1(44.45,2.01) 45.43,2.01 45.44,2 LED2.1
  Bottom Layer w0.2: v1(44.45,2.01) 43.05,3.41 43.05,8.36 44.02,9.33 44.02,42.95 36.24,50.73 32.08,50.73 30.8,49.45 v1(30.8,48.62)
BEC_FB: length 3.9
  Top Layer w0.574: U15.4 53.71,70.72 R6.2 R5.1
CAM_CLK_N: length 4.7
  Top Layer w0.133: U2.40 27.2,10.04 27.19,10.03 27.19,6.13 27.24,6.08 FPC1.8
CAM_CLK_P: length 4.7
  Top Layer w0.133: U2.42 26.8,10.04 26.81,10.03 26.81,6.13 26.76,6.08 FPC1.7
CAM_D0_N: length 7.2
  Top Layer w0.133: FPC1.14 33.24,6.08 33.19,6.13 33.19,8.22 31.91,9.5 30.06,9.5 29.59,9.97 29.59,10.03 29.6,10.04 U2.28
CAM_D0_P: length 7.2
  Top Layer w0.133: U2.30 29.2,10.04 29.21,10.03 29.21,9.81 29.9,9.12 31.75,9.12 32.81,8.06 32.81,6.13 32.76,6.09 FPC1.13
CAM_D1_N: length 5.4
  Top Layer w0.133: U2.34 28.4,10.04 28.39,10.03 28.39,9.97 30.19,8.17 30.19,6.13 30.24,6.09 FPC1.11
CAM_D1_P: length 5.4
  Top Layer w0.133: FPC1.10 29.76,6.09 29.81,6.13 29.81,8.01 28.01,9.81 28.01,10.03 28,10.04 U2.36
CAM_GPIO: length 59.5
  Top Layer w0.2: v1(15.62,46.71) 15.62,47.52 U1.97 ; FPC1.5 v1(24.5,7.98)
  Bottom Layer w0.2: v1(15.62,46.71) 15.88,46.46 30.23,46.46 31.62,45.06 31.62,42.9 24.64,35.92 24.51,35.92 24.51,7.99 v1(24.5,7.98)
CAM_SCL: length 56.9
  Top Layer w0.2: R3.2 17.91,8.11 19.05,9.25 21.28,9.25 21.59,8.94 21.59,7.85 22.1,7.34 22.35,7.34 22.5,7.2 FPC1.3 v1(22.5,3.91) ; v1(28.7,45.57) 28,46.27 U1.35
  Bottom Layer w0.2: v1(28.7,45.57) 29.21,45.06 29.21,42.65 22.5,35.94 v1(22.5,3.91)
CAM_SDA: length 51.4
  Top Layer w0.2: R4.2 v1(19.05,6.58) ; v1(28,43.54) U1.36 ; FPC1.2 v1(21.5,3.91)
  Bottom Layer w0.2: v1(28,43.54) 21.5,37.04 v1(21.5,3.91) 19.81,3.91 19.05,4.68 v1(19.05,6.58)
CM4_3V3: length 41.6
  Top Layer w0.2: U1.78 19.6,43.83 19.3,43.54 18.4,43.54 ; U1.84 18.4,43.54 ; 18.4,43.54 18,43.94 U1.86
  Top Layer w0.5: R1.1 13.08,8.11 13.08,19.16 18.4,24.47 18.4,43.54
EXT_3V3: length 10.9
  Top Layer w0.5: R2.1 12.19,5.19 11.9,4.9 C16.1 10.96,4.8 U14.2 U14.4
GLOBAL_EN: length 18
  Top Layer w0.2: v1(14.48,48.24) 14.5,48.24 U1.99 ; 8.44,51.42 SW1.2 SW1.1 ; 8.44,51.42 v1(8.44,50.14) ; 8.44,51.42 C19.2
  Bottom Layer w0.2: v1(14.48,48.24) 12.57,50.14 v1(8.44,50.14)
PWR_LED: length 75.3
  Top Layer w0.2: LED1.1 45.5,3.62 45.34,3.79 v1(44.32,3.79) ; U1.95 v1(16,48.62)
  Bottom Layer w0.2: v1(16,48.62) 16,50.01 17.02,51.03 36.45,51.03 44.32,43.16 v1(44.32,3.79)
RX0: length 42
  Top Layer w0.2: H2.2 4.74,76.76 6.19,76.76 15.41,67.54 15.41,57.25 21.33,51.33 22.1,51.33 24.8,48.63 U1.51
RX3: length 45
  Top Layer w0.2: U1.34 28.4,44.91 27.74,45.57 22.22,45.57 22.1,45.44 14.52,45.44 12.06,47.9 12.06,62.59 5.84,68.81 2.69,68.81 H3.2
TX0: length 40.4
  Top Layer w0.2: H2.1 6.07,76.46 15.11,67.42 15.11,57.13 21.21,51.03 21.97,51.03 24,49 U1.55
TX3: length 40
  Top Layer w0.2: H3.1 7.77,66.46 11.76,62.46 11.76,47.78 14.47,45.07 22.15,45.07 22.35,45.27 24,45.27 24.4,44.87 U1.54
USB_ID: length 14
  Top Layer w0.2: R7.1 37.37,13.54 U2.1
USB_N: length 56.9
  Top Layer w0.146: H1.3 27.18,57 27.33,57.15 27.33,58.02 28.72,59.41 32.64,59.41 33.66,58.4 33.66,51.65 37.3,48 37.3,42.23 34.37,39.3 34.37,13.99 34.4,13.96 U2.3
USB_P: length 57
  Top Layer w0.146: U2.5 34,13.96 34.03,13.99 34.03,27.27 33.88,27.41 33.42,27.41 33.27,27.56 33.27,28.79 33.42,28.94 33.88,28.94 34.03,29.08 34.03,39.45 36.96,42.38 36.96,47.86 33.31,51.5 33.31,58.25 32.5,59.07 28.86,59.07 27.67,57.88 27.67,57.14 27.81,57 H1.2
$1N6119: length 3.7
  Top Layer w0.574: C1.1 51.05,65.13 51.44,65.51 51.44,66.88 U15.1
$1N8732: length 1.7
  Top Layer w0.2: R8.1 48.77,3.78 LED1.2
$1N8740: length 1.7
  Top Layer w0.2: LED2.2 48.77,2 R9.1

## Copper pours and planes (outline as drawn; the poured copper is in the pictures)
5V on Top Layer: 51.94,62.33 54.86,62.33 54.86,43.01 43.21,43.01 43.15,42.95 43.15,48.44 51.94,48.44
5V on Inner2: -8.51,102.09 63.75,102.09 63.75,-10.82 -8.51,-10.82
GND on Top Layer: -1.27,93.45 43.94,93.45 43.94,40.36 56.9,40.36 56.9,-1.93 -1.27,-1.93
GND on Top Layer: 48.13,76.56 55,76.56 55,71.52 50.11,71.52 50.16,71.47 50.16,67.62 47.45,67.62 47.45,69.07 44.82,69.07 44.82,70.07 44.83,70.08 48.16,70.08 48.16,76.54
GND on Top Layer: 42.8,91.8 55,91.8 55,83.52 42.8,83.52
GND on Top Layer: 48.9,62.33 51.31,62.33 51.31,49 43.05,49 43.05,52.56 48.88,52.56 48.9,52.57
GND on Bottom Layer: -13.97,107.8 68.83,107.8 68.83,-14.75 -13.97,-14.75
GND on Inner1: -4.44,97.26 58.93,97.26 58.93,-5.74 -4.44,-5.74
BEC_IN on Top Layer: 55,76.91 54.97,76.94 47.88,76.94 47.88,71.48 44.19,71.48 44.19,68.81 47.12,68.81 47.12,67.59 42.8,67.59 42.8,82.51 55,82.51
$1N6118 on Top Layer: 42.93,67.29 48.39,67.29 48.39,53.44 42.93,53.44

## Text on the board
Top Silkscreen Layer: GND | RX0 | TX0 | RX3 | TX3 | 2-6S
